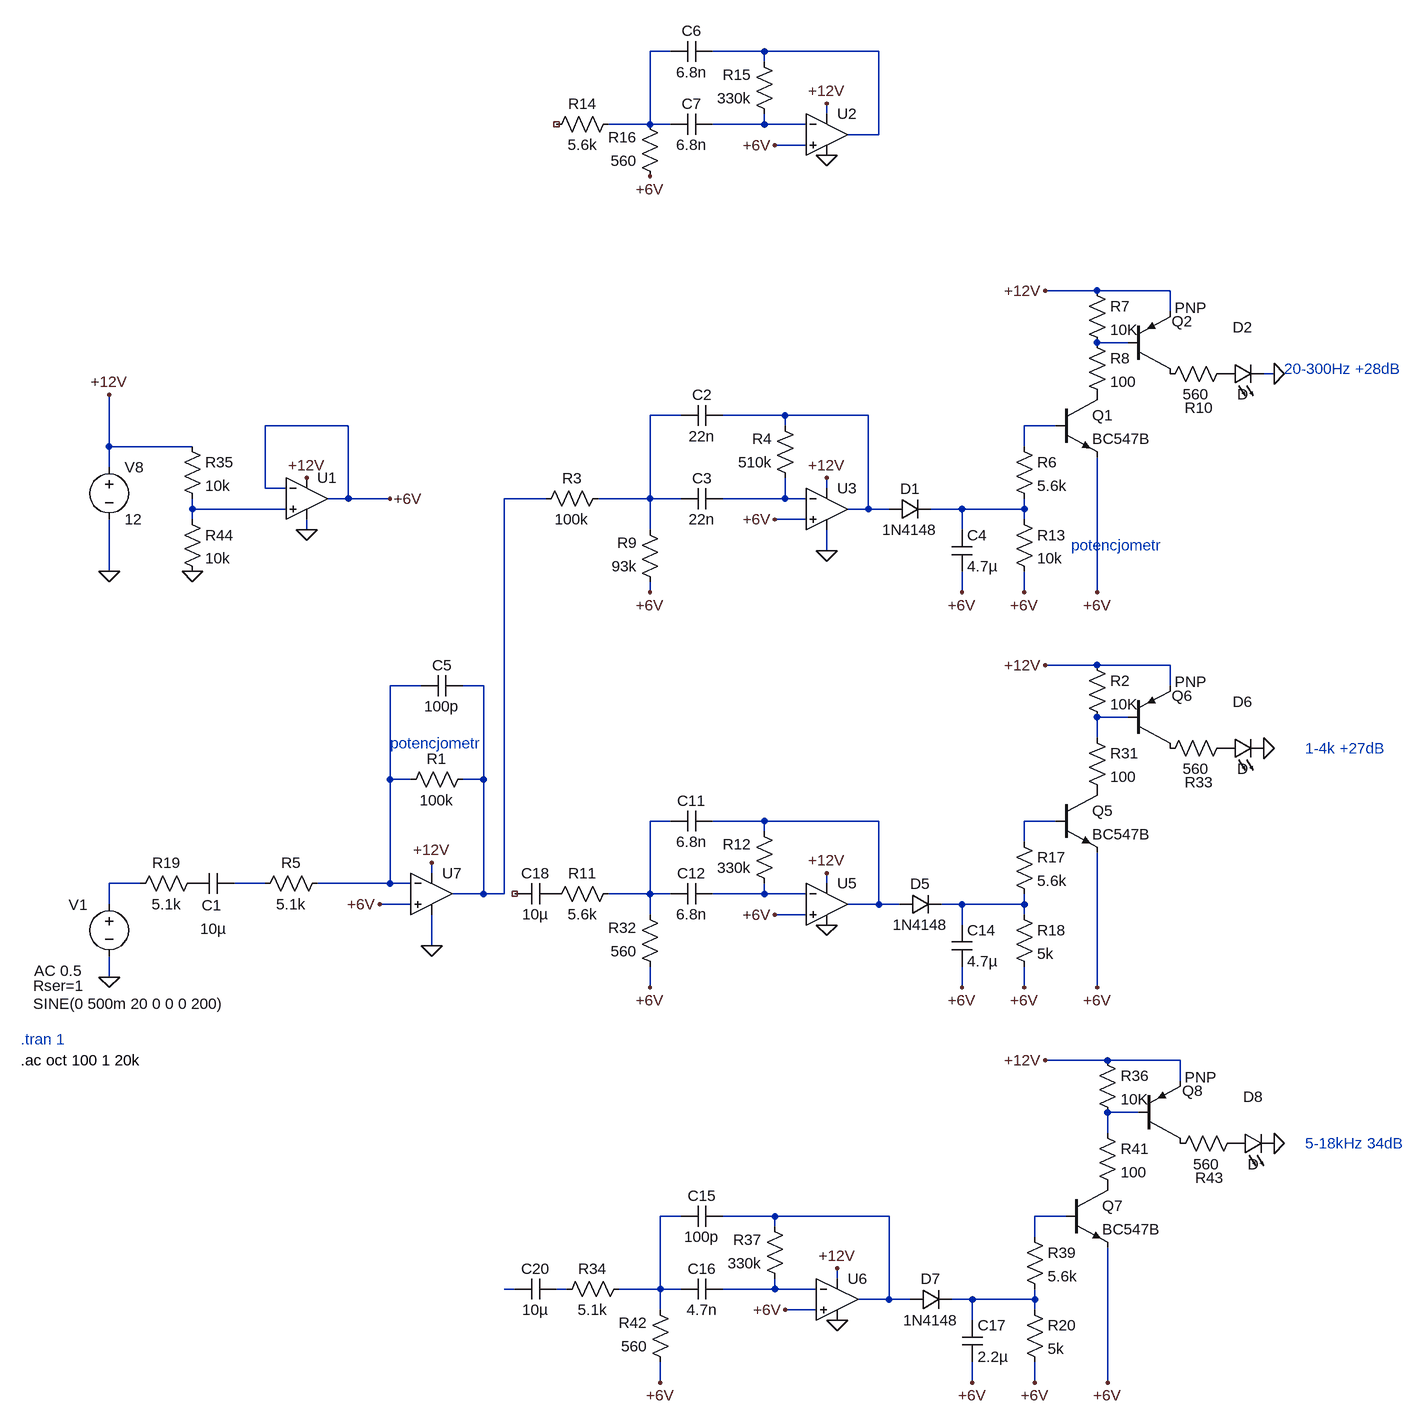
[diagram p0: schematic Colorofon2026.asc]
Colorofon2026.asc, the LTspice schematic file:
Version 4.1
SHEET 1 3828 2844
WIRE 224 704 192 704
WIRE 368 704 288 704
WIRE 544 704 368 704
WIRE 368 720 368 704
WIRE 464 800 464 784
WIRE 192 816 192 704
WIRE 192 816 128 816
WIRE 224 816 192 816
WIRE 368 816 368 800
WIRE 368 816 288 816
WIRE 432 816 368 816
WIRE 544 832 544 704
WIRE 544 832 496 832
WIRE 432 848 384 848
WIRE 880 1072 800 1072
WIRE 992 1072 880 1072
WIRE 992 1104 992 1072
WIRE 928 1152 880 1152
WIRE 1152 1200 1136 1200
WIRE 240 1264 192 1264
WIRE 400 1264 304 1264
WIRE 528 1264 400 1264
WIRE -272 1280 -400 1280
WIRE 400 1280 400 1264
WIRE 816 1280 768 1280
WIRE -640 1312 -640 1232
WIRE -512 1312 -640 1312
WIRE 768 1312 768 1280
WIRE -640 1344 -640 1312
WIRE -400 1376 -400 1280
WIRE -368 1376 -400 1376
WIRE 464 1376 464 1360
WIRE -272 1392 -272 1280
WIRE -272 1392 -304 1392
WIRE -208 1392 -272 1392
WIRE 32 1392 -32 1392
WIRE 192 1392 192 1264
WIRE 192 1392 112 1392
WIRE 240 1392 192 1392
WIRE 400 1392 400 1360
WIRE 400 1392 304 1392
WIRE 432 1392 400 1392
WIRE -512 1408 -512 1392
WIRE -368 1408 -512 1408
WIRE 528 1408 528 1264
WIRE 528 1408 496 1408
WIRE 560 1408 528 1408
WIRE 672 1408 624 1408
WIRE 768 1408 768 1392
WIRE 768 1408 672 1408
WIRE -512 1424 -512 1408
WIRE 432 1424 384 1424
WIRE 768 1424 768 1408
WIRE -336 1440 -336 1424
WIRE 192 1440 192 1392
WIRE 672 1440 672 1408
WIRE 464 1472 464 1440
WIRE -640 1504 -640 1424
WIRE 192 1536 192 1520
WIRE 672 1536 672 1504
WIRE 768 1536 768 1504
WIRE 880 1536 880 1328
WIRE 880 1648 800 1648
WIRE 992 1648 880 1648
WIRE -160 1680 -208 1680
WIRE -64 1680 -96 1680
WIRE 992 1680 992 1648
WIRE 928 1728 880 1728
WIRE 880 1760 880 1728
WIRE -208 1824 -208 1680
WIRE -176 1824 -208 1824
WIRE -64 1824 -64 1680
WIRE -64 1824 -96 1824
WIRE 224 1888 192 1888
WIRE 368 1888 288 1888
WIRE 544 1888 368 1888
WIRE 816 1888 768 1888
WIRE 368 1904 368 1888
WIRE 768 1920 768 1888
WIRE -144 1968 -144 1952
WIRE -592 1984 -640 1984
WIRE -400 1984 -448 1984
WIRE -208 1984 -208 1824
WIRE -208 1984 -320 1984
WIRE -176 1984 -208 1984
WIRE 464 1984 464 1968
WIRE -64 2000 -64 1824
WIRE -64 2000 -112 2000
WIRE -32 2000 -32 1392
WIRE -32 2000 -64 2000
WIRE 192 2000 192 1888
WIRE 192 2000 128 2000
WIRE 224 2000 192 2000
WIRE 368 2000 368 1984
WIRE 368 2000 288 2000
WIRE 432 2000 368 2000
WIRE -640 2016 -640 1984
WIRE -176 2016 -224 2016
WIRE 544 2016 544 1888
WIRE 544 2016 496 2016
WIRE 576 2016 544 2016
WIRE 672 2016 640 2016
WIRE 768 2016 768 2000
WIRE 768 2016 672 2016
WIRE 192 2032 192 2000
WIRE 432 2032 384 2032
WIRE 768 2032 768 2016
WIRE 672 2048 672 2016
WIRE -144 2080 -144 2032
WIRE -640 2128 -640 2096
WIRE 192 2144 192 2112
WIRE 672 2144 672 2112
WIRE 768 2144 768 2112
WIRE 880 2144 880 1936
WIRE 896 2256 800 2256
WIRE 1008 2256 896 2256
WIRE 1008 2288 1008 2256
WIRE 944 2336 896 2336
WIRE 896 2368 896 2336
WIRE 240 2496 208 2496
WIRE 384 2496 304 2496
WIRE 560 2496 384 2496
WIRE 832 2496 784 2496
WIRE 384 2512 384 2496
WIRE 784 2528 784 2496
WIRE 480 2592 480 2576
WIRE -16 2608 -32 2608
WIRE 64 2608 48 2608
WIRE 208 2608 208 2496
WIRE 208 2608 144 2608
WIRE 240 2608 208 2608
WIRE 384 2608 384 2592
WIRE 384 2608 304 2608
WIRE 448 2608 384 2608
WIRE 560 2624 560 2496
WIRE 560 2624 512 2624
WIRE 592 2624 560 2624
WIRE 688 2624 656 2624
WIRE 784 2624 784 2608
WIRE 784 2624 688 2624
WIRE 208 2640 208 2608
WIRE 448 2640 400 2640
WIRE 784 2640 784 2624
WIRE 688 2656 688 2624
WIRE 208 2752 208 2720
WIRE 688 2752 688 2720
WIRE 784 2752 784 2720
WIRE 896 2752 896 2544
FLAG -640 1504 0
FLAG -640 2128 0
FLAG -144 2080 0
FLAG -224 2016 +6V
FLAG 464 1472 0
FLAG 384 1424 +6V
FLAG 1152 1200 0
FLAG 880 1536 +6V
FLAG -144 1952 +12V
FLAG 464 1360 +12V
FLAG 464 2048 0
FLAG 384 2032 +6V
FLAG 1136 1776 0
FLAG 672 2144 +6V
FLAG 768 2144 +6V
FLAG 880 2144 +6V
FLAG 464 1968 +12V
FLAG 480 2656 0
FLAG 400 2640 +6V
FLAG 1152 2384 0
FLAG 688 2752 +6V
FLAG 784 2752 +6V
FLAG 896 2752 +6V
FLAG 480 2576 +12V
FLAG 192 1536 +6V
FLAG 192 2144 +6V
FLAG 208 2752 +6V
FLAG -512 1504 0
FLAG -640 1232 +12V
FLAG -336 1360 +12V
FLAG 800 1072 +12V
FLAG -208 1392 +6V
FLAG 800 1648 +12V
FLAG 800 2256 +12V
FLAG -336 1440 0
FLAG 768 1536 +6V
FLAG 672 1536 +6V
FLAG 464 864 0
FLAG 384 848 +6V
FLAG 464 784 +12V
FLAG 192 896 +6V
SYMBOL voltage -640 1328 R0
WINDOW 123 0 0 Left 0
WINDOW 39 0 0 Left 0
SYMATTR InstName V8
SYMATTR Value 12
SYMBOL voltage -640 2000 R0
WINDOW 123 -115 118 Left 2
WINDOW 39 -117 141 Left 2
WINDOW 3 -117 169 Left 2
WINDOW 0 -62 17 Left 2
SYMATTR Value2 AC 0.5
SYMATTR SpiceLine Rser=1
SYMATTR Value SINE(0 500m 20 0 0 0 200)
SYMATTR InstName V1
SYMBOL res -80 1808 R90
WINDOW 0 0 56 VBottom 2
WINDOW 3 32 56 VTop 2
SYMATTR InstName R1
SYMATTR Value 100k
SYMBOL cap -448 1968 R90
WINDOW 0 65 34 VBottom 2
WINDOW 3 70 32 VTop 2
SYMATTR InstName C1
SYMATTR Value 10µ
SYMBOL cap 304 1248 R90
WINDOW 0 0 32 VBottom 2
WINDOW 3 32 32 VTop 2
SYMATTR InstName C2
SYMATTR Value 22n
SYMBOL diode 560 1424 R270
WINDOW 0 32 32 VTop 2
WINDOW 3 0 32 VBottom 2
SYMATTR InstName D1
SYMATTR Value 1N4148
SYMBOL cap 656 1440 R0
SYMATTR Value 4.7µ
SYMATTR InstName C4
SYMATTR SpiceLine V=35 Irms=8.4m Rser=1.5 Lser=550f
SYMBOL res 752 1296 R0
SYMATTR InstName R6
SYMATTR Value 5.6k
SYMBOL npn 816 1232 R0
SYMATTR InstName Q1
SYMATTR Value BC547B
SYMBOL res 864 1136 R0
SYMATTR InstName R8
SYMATTR Value 100
SYMBOL LED 1072 1216 R270
WINDOW 0 72 32 VTop 2
WINDOW 3 0 32 VBottom 2
SYMATTR InstName D2
SYMBOL pnp 928 1200 M180
WINDOW 0 67 81 Left 2
WINDOW 3 71 102 Left 2
SYMATTR InstName Q2
SYMBOL res 1088 1184 R90
WINDOW 0 84 51 VBottom 2
WINDOW 3 32 56 VTop 2
SYMATTR InstName R10
SYMATTR Value 560
SYMBOL res 144 1984 R90
WINDOW 0 0 56 VBottom 2
WINDOW 3 32 56 VTop 2
SYMATTR InstName R11
SYMATTR Value 5.6k
SYMBOL res 384 2000 R180
WINDOW 0 36 76 Left 2
WINDOW 3 36 40 Left 2
SYMATTR InstName R12
SYMATTR Value 330k
SYMBOL cap 288 1872 R90
WINDOW 0 0 32 VBottom 2
WINDOW 3 32 32 VTop 2
SYMATTR InstName C11
SYMATTR Value 6.8n
SYMBOL cap 224 2016 R270
WINDOW 0 32 32 VTop 2
WINDOW 3 0 32 VBottom 2
SYMATTR InstName C12
SYMATTR Value 6.8n
SYMBOL diode 576 2032 R270
WINDOW 0 32 32 VTop 2
WINDOW 3 0 32 VBottom 2
SYMATTR InstName D5
SYMATTR Value 1N4148
SYMBOL cap 656 2048 R0
SYMATTR Value 4.7µ
SYMATTR InstName C14
SYMATTR SpiceLine V=35 Irms=8.4m Rser=1.5 Lser=550f
SYMBOL res 752 1904 R0
SYMATTR InstName R17
SYMATTR Value 5.6k
SYMBOL npn 816 1840 R0
SYMATTR InstName Q5
SYMATTR Value BC547B
SYMBOL res 864 1744 R0
SYMATTR InstName R31
SYMATTR Value 100
SYMBOL LED 1072 1792 R270
WINDOW 0 72 32 VTop 2
WINDOW 3 0 32 VBottom 2
SYMATTR InstName D6
SYMBOL res 208 2128 R180
WINDOW 0 36 76 Left 2
WINDOW 3 36 40 Left 2
SYMATTR InstName R32
SYMATTR Value 560
SYMBOL pnp 928 1776 M180
WINDOW 0 67 81 Left 2
WINDOW 3 71 102 Left 2
SYMATTR InstName Q6
SYMBOL res 1088 1760 R90
WINDOW 0 84 51 VBottom 2
WINDOW 3 32 56 VTop 2
SYMATTR InstName R33
SYMATTR Value 560
SYMBOL res 160 2592 R90
WINDOW 0 0 56 VBottom 2
WINDOW 3 32 56 VTop 2
SYMATTR InstName R34
SYMATTR Value 5.1k
SYMBOL res 400 2608 R180
WINDOW 0 36 76 Left 2
WINDOW 3 36 40 Left 2
SYMATTR InstName R37
SYMATTR Value 330k
SYMBOL cap 304 2480 R90
WINDOW 0 0 32 VBottom 2
WINDOW 3 32 32 VTop 2
SYMATTR InstName C15
SYMATTR Value 100p
SYMBOL cap 240 2624 R270
WINDOW 0 32 32 VTop 2
WINDOW 3 0 32 VBottom 2
SYMATTR InstName C16
SYMATTR Value 4.7n
SYMBOL diode 592 2640 R270
WINDOW 0 32 32 VTop 2
WINDOW 3 0 32 VBottom 2
SYMATTR InstName D7
SYMATTR Value 1N4148
SYMBOL cap 672 2656 R0
SYMATTR Value 2.2µ
SYMATTR InstName C17
SYMATTR SpiceLine V=35 Irms=8.4m Rser=1.5 Lser=550f mfg="Würth Elektronik" pn="865250540001 WCAP-ASNP 4.3x4.3" type="Al electrolytic"
SYMBOL res 768 2512 R0
SYMATTR InstName R39
SYMATTR Value 5.6k
SYMBOL npn 832 2448 R0
SYMATTR InstName Q7
SYMATTR Value BC547B
SYMBOL res 880 2352 R0
SYMATTR InstName R41
SYMATTR Value 100
SYMBOL LED 1088 2400 R270
WINDOW 0 72 32 VTop 2
WINDOW 3 0 32 VBottom 2
SYMATTR InstName D8
SYMBOL res 224 2736 R180
WINDOW 0 36 76 Left 2
WINDOW 3 36 40 Left 2
SYMATTR InstName R42
SYMATTR Value 560
SYMBOL pnp 944 2384 M180
WINDOW 0 67 81 Left 2
WINDOW 3 71 102 Left 2
SYMATTR InstName Q8
SYMBOL res 1104 2368 R90
WINDOW 0 84 51 VBottom 2
WINDOW 3 32 56 VTop 2
SYMATTR InstName R43
SYMATTR Value 560
SYMBOL cap -16 2016 R270
WINDOW 0 32 32 VTop 2
WINDOW 3 0 32 VBottom 2
SYMATTR InstName C18
SYMATTR Value 10µ
SYMBOL cap -16 2624 R270
WINDOW 0 32 32 VTop 2
WINDOW 3 0 32 VBottom 2
SYMATTR InstName C20
SYMATTR Value 10µ
SYMBOL res 864 1056 R0
SYMATTR InstName R7
SYMATTR Value 10K
SYMBOL res -528 1296 R0
SYMATTR InstName R35
SYMATTR Value 10k
SYMBOL res -528 1408 R0
SYMATTR InstName R44
SYMATTR Value 10k
SYMBOL res 864 1632 R0
SYMATTR InstName R2
SYMATTR Value 10K
SYMBOL res 880 2240 R0
SYMATTR InstName R36
SYMATTR Value 10K
SYMBOL OpAmps\\UniversalOpAmp -336 1392 R0
SYMATTR InstName U1
SYMBOL OpAmps\\UniversalOpAmp -144 2000 R0
SYMATTR InstName U7
SYMBOL OpAmps\\UniversalOpAmp 464 1408 R0
SYMATTR InstName U3
SYMBOL OpAmps\\UniversalOpAmp 464 2016 R0
SYMATTR InstName U5
SYMBOL OpAmps\\UniversalOpAmp 480 2624 R0
SYMATTR InstName U6
SYMBOL res 752 1408 R0
SYMATTR InstName R13
SYMATTR Value 10k
SYMBOL cap 304 1376 R90
WINDOW 0 0 32 VBottom 2
WINDOW 3 32 32 VTop 2
SYMATTR InstName C3
SYMATTR Value 22n
SYMBOL res 416 1376 R180
WINDOW 0 36 76 Left 2
WINDOW 3 36 40 Left 2
SYMATTR InstName R4
SYMATTR Value 510k
SYMBOL res 16 1408 R270
WINDOW 0 32 56 VTop 2
WINDOW 3 0 56 VBottom 2
SYMATTR InstName R3
SYMATTR Value 100k
SYMBOL res 208 1536 R180
WINDOW 0 36 76 Left 2
WINDOW 3 36 40 Left 2
SYMATTR InstName R9
SYMATTR Value 93k
SYMBOL res 144 800 R90
WINDOW 0 0 56 VBottom 2
WINDOW 3 32 56 VTop 2
SYMATTR InstName R14
SYMATTR Value 5.6k
SYMBOL res 384 816 R180
WINDOW 0 36 76 Left 2
WINDOW 3 36 40 Left 2
SYMATTR InstName R15
SYMATTR Value 330k
SYMBOL cap 288 688 R90
WINDOW 0 0 32 VBottom 2
WINDOW 3 32 32 VTop 2
SYMATTR InstName C6
SYMATTR Value 6.8n
SYMBOL cap 224 832 R270
WINDOW 0 32 32 VTop 2
WINDOW 3 0 32 VBottom 2
SYMATTR InstName C7
SYMATTR Value 6.8n
SYMBOL res 208 912 R180
WINDOW 0 36 76 Left 2
WINDOW 3 36 40 Left 2
SYMATTR InstName R16
SYMATTR Value 560
SYMBOL OpAmps\\UniversalOpAmp 464 832 R0
SYMATTR InstName U2
SYMBOL res 752 2016 R0
SYMATTR InstName R18
SYMATTR Value 5k
SYMBOL res 768 2624 R0
SYMATTR InstName R20
SYMATTR Value 5k
SYMBOL res -496 1968 R90
WINDOW 0 0 56 VBottom 2
WINDOW 3 32 56 VTop 2
SYMATTR InstName R19
SYMATTR Value 5.1k
SYMBOL res -304 1968 R90
WINDOW 0 0 56 VBottom 2
WINDOW 3 32 56 VTop 2
SYMATTR InstName R5
SYMATTR Value 5.1k
SYMBOL cap -96 1664 R90
WINDOW 0 0 32 VBottom 2
WINDOW 3 32 32 VTop 2
SYMATTR InstName C5
SYMATTR Value 100p
TEXT -776 2224 Left 2 ;.tran 1
TEXT -776 2256 Left 2 !.ac oct 100 1 20k
TEXT 1200 1776 Left 2 ;1-4k +27dB
TEXT 1200 2384 Left 2 ;5-18kHz 34dB
TEXT 1168 1192 Left 2 ;20-300Hz +28dB
TEXT -208 1768 Left 2 ;potencjometr
TEXT 840 1464 Left 2 ;potencjometr

The netlist it stands for:
* Colorofon2026.asc
V8 +12V 0 12
V1 N017 0 SINE(0 500m 20 0 0 0 200) AC 0.5 Rser=1
R1 N008 N012 100k
C1 N018 P001 10µ
C2 N006 N005 22n
D1 N006 N011 1N4148
C4 N011 +6V 4.7µ V=35 Irms=8.4m Rser=1.5 Lser=550f
R6 N007 N011 5.6k
Q1 P002 N007 +6V 0 BC547B
R8 N004 P002 100
D2 P003 0 D
Q2 P004 N004 +12V 0 PNP
R10 P003 P004 560
R11 N014 P005 5.6k
R12 N019 N015 330k
C11 N015 N014 6.8n
C12 N014 N019 6.8n
D5 N015 N020 1N4148
C14 N020 +6V 4.7µ V=35 Irms=8.4m Rser=1.5 Lser=550f
R17 N016 N020 5.6k
Q5 P006 N016 +6V 0 BC547B
R31 N013 P006 100
D6 P007 0 D
R32 +6V N014 560
Q6 P008 N013 +12V 0 PNP
R33 P007 P008 560
R34 N022 N026 5.1k
R37 N027 N023 330k
C15 N023 N022 100p
C16 N022 N027 4.7n
D7 N023 N028 1N4148
C17 N028 +6V 2.2µ V=35 Irms=8.4m Rser=1.5 Lser=550f mfg="Würth Elektronik" pn="865250540001 WCAP-ASNP 4.3x4.3" type="Al electrolytic"
R39 N024 N028 5.6k
Q7 P009 N024 +6V 0 BC547B
R41 N021 P009 100
D8 P010 0 D
R42 +6V N022 560
Q8 P011 N021 +12V 0 PNP
R43 P010 P011 560
C18 NC_01 P005 10µ
C20 N025 N026 10µ
R7 +12V N004 10K
R35 +12V N010 10k
R44 N010 0 10k
R2 +12V N013 10K
R36 +12V N021 10K
X§U1 N010 +6V +12V 0 +6V level1 Avol=1Meg GBW=10Meg Vos=0 En=0 Enk=0 In=0 Ink=0 Rin=500Meg  ; pins In+ In- V+ V- OUT
X§U7 +6V N012 +12V 0 N008 level1 Avol=1Meg GBW=10Meg Vos=0 En=0 Enk=0 In=0 Ink=0 Rin=500Meg  ; pins In+ In- V+ V- OUT
X§U3 +6V N009 +12V 0 N006 level1 Avol=1Meg GBW=10Meg Vos=0 En=0 Enk=0 In=0 Ink=0 Rin=500Meg  ; pins In+ In- V+ V- OUT
X§U5 +6V N019 +12V 0 N015 level1 Avol=1Meg GBW=10Meg Vos=0 En=0 Enk=0 In=0 Ink=0 Rin=500Meg  ; pins In+ In- V+ V- OUT
X§U6 +6V N027 +12V 0 N023 level1 Avol=1Meg GBW=10Meg Vos=0 En=0 Enk=0 In=0 Ink=0 Rin=500Meg  ; pins In+ In- V+ V- OUT
R13 N011 +6V 10k
C3 N009 N005 22n
R4 N009 N006 510k
R3 N008 N005 100k
R9 +6V N005 93k
R14 N001 NC_02 5.6k
R15 N003 N002 330k
C6 N002 N001 6.8n
C7 N001 N003 6.8n
R16 +6V N001 560
X§U2 +6V N003 +12V 0 N002 level1 Avol=1Meg GBW=10Meg Vos=0 En=0 Enk=0 In=0 Ink=0 Rin=500Meg  ; pins In+ In- V+ V- OUT
R18 N020 +6V 5k
R20 N028 +6V 5k
R19 P001 N017 5.1k
R5 N012 N018 5.1k
C5 N008 N012 100p
.model D D
.lib standard.dio
.model NPN NPN
.model PNP PNP
.lib standard.bjt
* .tran 1
.ac oct 100 1 20k
* 1-4k +27dB
* 5-18kHz 34dB
* 20-300Hz +28dB
* potencjometr
* potencjometr
.lib UniversalOpAmp1.lib
.backanno
.end